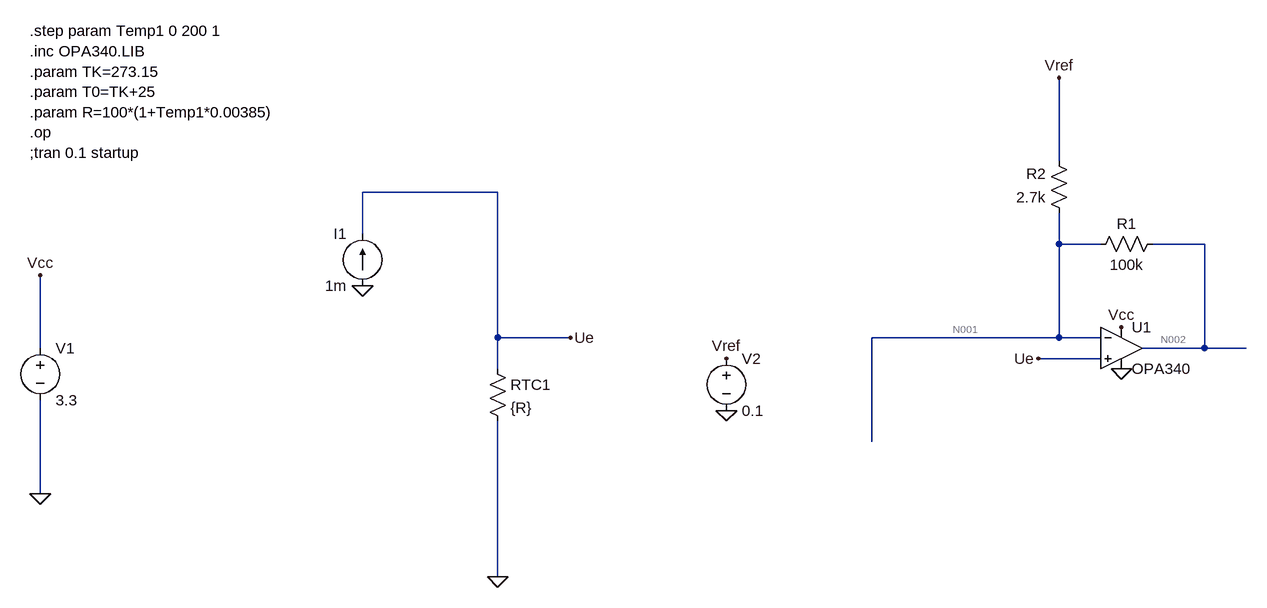
[diagram p0: schematic PT1000_Circuit_v03.asc]
PT1000_Circuit_v03.asc, the LTspice schematic file:
Version 4
SHEET 1 1396 680
WIRE 416 -224 416 -352
WIRE -448 -176 -656 -176
WIRE -656 -112 -656 -176
WIRE 416 -96 416 -144
WIRE 480 -96 416 -96
WIRE 640 -96 560 -96
WIRE -448 48 -448 -176
WIRE -336 48 -448 48
WIRE 416 48 416 -96
WIRE 416 48 128 48
WIRE 480 48 416 48
WIRE -1152 64 -1152 -48
WIRE 640 64 640 -96
WIRE 640 64 544 64
WIRE 704 64 640 64
WIRE 480 80 384 80
WIRE -448 96 -448 48
WIRE 128 208 128 48
WIRE -1152 288 -1152 144
WIRE -448 416 -448 176
FLAG -1152 288 0
FLAG -1152 -48 Vcc
FLAG -448 416 0
FLAG -656 -32 0
FLAG -336 48 Ue
FLAG 512 32 Vcc
FLAG 384 80 Ue
FLAG 416 -352 Vref
FLAG 512 96 0
FLAG -96 160 0
FLAG -96 80 Vref
SYMBOL voltage -1152 48 R0
WINDOW 123 0 0 Left 2
WINDOW 39 0 0 Left 2
SYMATTR InstName V1
SYMATTR Value 3.3
SYMBOL res -464 80 R0
SYMATTR InstName RTC1
SYMATTR Value {R}
SYMBOL current -656 -32 R180
WINDOW 0 24 80 Left 2
WINDOW 3 24 0 Left 2
WINDOW 123 0 0 Left 2
WINDOW 39 0 0 Left 2
SYMATTR InstName I1
SYMATTR Value 1m
SYMBOL Opamps\\opamp2 512 0 R0
SYMATTR InstName U1
SYMATTR Value OPA340
SYMATTR SpiceModel OPA340
SYMBOL res 576 -112 R90
WINDOW 0 0 56 VBottom 2
WINDOW 3 32 56 VTop 2
SYMATTR InstName R1
SYMATTR Value 100k
SYMBOL res 432 -128 R180
WINDOW 0 36 76 Left 2
WINDOW 3 36 40 Left 2
SYMATTR InstName R2
SYMATTR Value 2.7k
SYMBOL voltage -96 64 R0
WINDOW 123 0 0 Left 2
WINDOW 39 0 0 Left 2
SYMATTR InstName V2
SYMATTR Value 0.1
TEXT -1168 -424 Left 2 !.step param Temp1 0 200 1\n.inc OPA340.LIB\n.param TK=273.15\n.param T0=TK+25\n.param R=100*(1+Temp1*0.00385)\n.op\n;tran 0.1 startup

The netlist it stands for:
* PT1000_Circuit_v03.asc
V1 Vcc 0 3.3
RTC1 Ue 0 {R}
I1 0 Ue 1m
XU1 Ue N001 Vcc 0 N002 OPA340 OPA340  ; pins In+ In- V+ V- OUT
R1 N002 N001 100k
R2 N001 Vref 2.7k
V2 Vref 0 0.1
.step param Temp1 0 200 1
.inc OPA340.LIB
.param TK=273.15
.param T0=TK+25
.param R=100*(1+Temp1*0.00385)
.op
;tran 0.1 startup
.backanno
.end

* Results of the author's LTspice run, read from the files saved beside the schematic
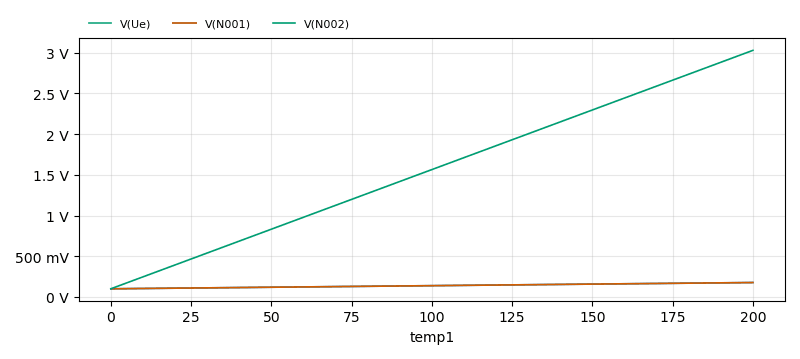
[diagram p1: Operating Point of PT1000_Circuit_v03.asc, plotted from the saved traces]
* Operating Point, 1 run:
*   V(Ue): 100 mV at temp1=0, 177 mV at temp1=200 , min 100 mV, max 177 mV
*   V(N001): 100 mV at temp1=0, 177 mV at temp1=200 , min 100 mV, max 177 mV
*   V(N002): 100 mV at temp1=0, 3.029 V at temp1=200 , min 100 mV, max 3.029 V
* From the log:
*   Semiconductor Device Operating Points:
*                           --- Diodes ---
*   Name:    d:u1:2      d:u1:1      d:u1:8      d:u1:7      d:u1:6
*   Model:    u1:dx       u1:dx       u1:dx       u1:dx       u1:dx
*   Id:     -2.90e-13   -2.90e-13   -1.10e-13   -1.10e-13   -3.21e-12
*   Vd:     -2.80e-01   -2.80e-01   -1.00e-01   -1.00e-01   -3.20e+00
*   Req:     1.00e+12    1.00e+12    9.92e+11    9.92e+11    1.00e+12
*   CAP:     8.84e-14    8.84e-14    9.53e-14    9.53e-14    4.88e-14
*   Name:    d:u1:5      d:u1:4      d:u1:3
*   Model:    u1:dx       u1:dx       u1:dx
*   Id:     -3.21e-12   -3.17e-13   -2.04e-12
*   Vd:     -3.20e+00   -3.07e-01   -2.03e+00
*   Req:     1.00e+12    1.00e+12    1.00e+12
*   CAP:     4.88e-14    8.75e-14    5.74e-14
*                           --- MOSFET Transistors ---
*   Name:       m:u1:114    m:u1:113     m:u1:2      m:u1:1      m:u1:9c
*   Model:       u1:nox      u1:pox      u1:nix      u1:nix      u1:nix
*   Id:          1.50e-04   -1.50e-04    6.30e-12    6.30e-12    5.03e-12
*   Vgs:         7.89e-01   -7.89e-01   -2.07e-01   -2.07e-01    1.06e+00
*   Vds:         1.10e-01   -3.21e+00    2.99e+00    2.99e+00    3.52e-09
*   Vbs:         0.00e+00    0.00e+00   -3.07e-01   -3.07e-01   -3.07e-01
*   Vth:         7.50e-01   -7.50e-01    7.50e-01    7.50e-01    7.50e-01
*   Vdsat:       3.92e-02   -3.92e-02    0.00e+00    0.00e+00    3.13e-01
*   Gm:          7.64e-03    7.64e-03    0.00e+00    0.00e+00    1.20e-11
*   Gds:         0.00e+00    0.00e+00    0.00e+00    0.00e+00    1.07e-03
*   Gmb:         0.00e+00    0.00e+00    0.00e+00    0.00e+00    0.00e+00
*   Cbd:         2.19e-13    1.05e-13    1.03e-13    1.03e-13    7.96e-13
*   Cbs:         2.34e-13    2.34e-13    1.99e-13    1.99e-13    7.96e-13
*   Cgsov:       1.00e-13    1.00e-13    1.00e-13    1.00e-13    4.00e-13
*   Cgdov:       1.00e-13    1.00e-13    1.00e-13    1.00e-13    4.00e-13
*   Cgbov:       1.88e-13    1.88e-13    1.00e-13    1.00e-13    4.00e-13
*   Cgs:         0.00e+00    0.00e+00    0.00e+00    0.00e+00    0.00e+00
*   Cgd:         0.00e+00    0.00e+00    0.00e+00    0.00e+00    0.00e+00
*   Cgb:         0.00e+00    0.00e+00    0.00e+00    0.00e+00    0.00e+00
*   Name:        m:u1:9      m:u1:8      m:u1:4      m:u1:3      m:u1:7
*   Model:       u1:nix      u1:nix      u1:pix      u1:pix      u1:pix
*   Id:          2.50e-12    5.11e-12   -7.50e-05   -7.50e-05   -5.11e-12
*   Vgs:         6.34e-01    6.34e-01   -1.17e+00   -1.17e+00    7.31e-01
*   Vds:         3.07e-01    6.34e-01   -9.06e-01   -9.06e-01   -6.34e-01
*   Vbs:         0.00e+00    0.00e+00    0.00e+00    0.00e+00    0.00e+00
*   Vth:         7.50e-01    7.50e-01   -7.50e-01   -7.50e-01   -7.50e-01
*   Vdsat:       0.00e+00    0.00e+00   -4.19e-01   -4.19e-01    0.00e+00
*   Gm:          0.00e+00    0.00e+00    3.58e-04    3.58e-04    0.00e+00
*   Gds:         0.00e+00    0.00e+00    0.00e+00    0.00e+00    0.00e+00
*   Gmb:         0.00e+00    0.00e+00    0.00e+00    0.00e+00    0.00e+00
*   Cbd:         7.96e-13    6.99e-13    1.60e-13    1.60e-13    6.99e-13
*   Cbs:         9.36e-13    9.36e-13    2.34e-13    2.34e-13    9.36e-13
*   Cgsov:       4.00e-13    4.00e-13    1.00e-13    1.00e-13    4.00e-13
*   Cgdov:       4.00e-13    4.00e-13    1.00e-13    1.00e-13    4.00e-13
*   Cgbov:       4.00e-13    4.00e-13    1.00e-13    1.00e-13    4.00e-13
*   Cgs:         0.00e+00    0.00e+00    0.00e+00    0.00e+00    0.00e+00
*   Cgd:         0.00e+00    0.00e+00    0.00e+00    0.00e+00    0.00e+00
*   Cgb:         0.00e+00    0.00e+00    0.00e+00    0.00e+00    0.00e+00